# Altium schematic sheet NucciF.SchDoc: NucciF (part 2 of 2)
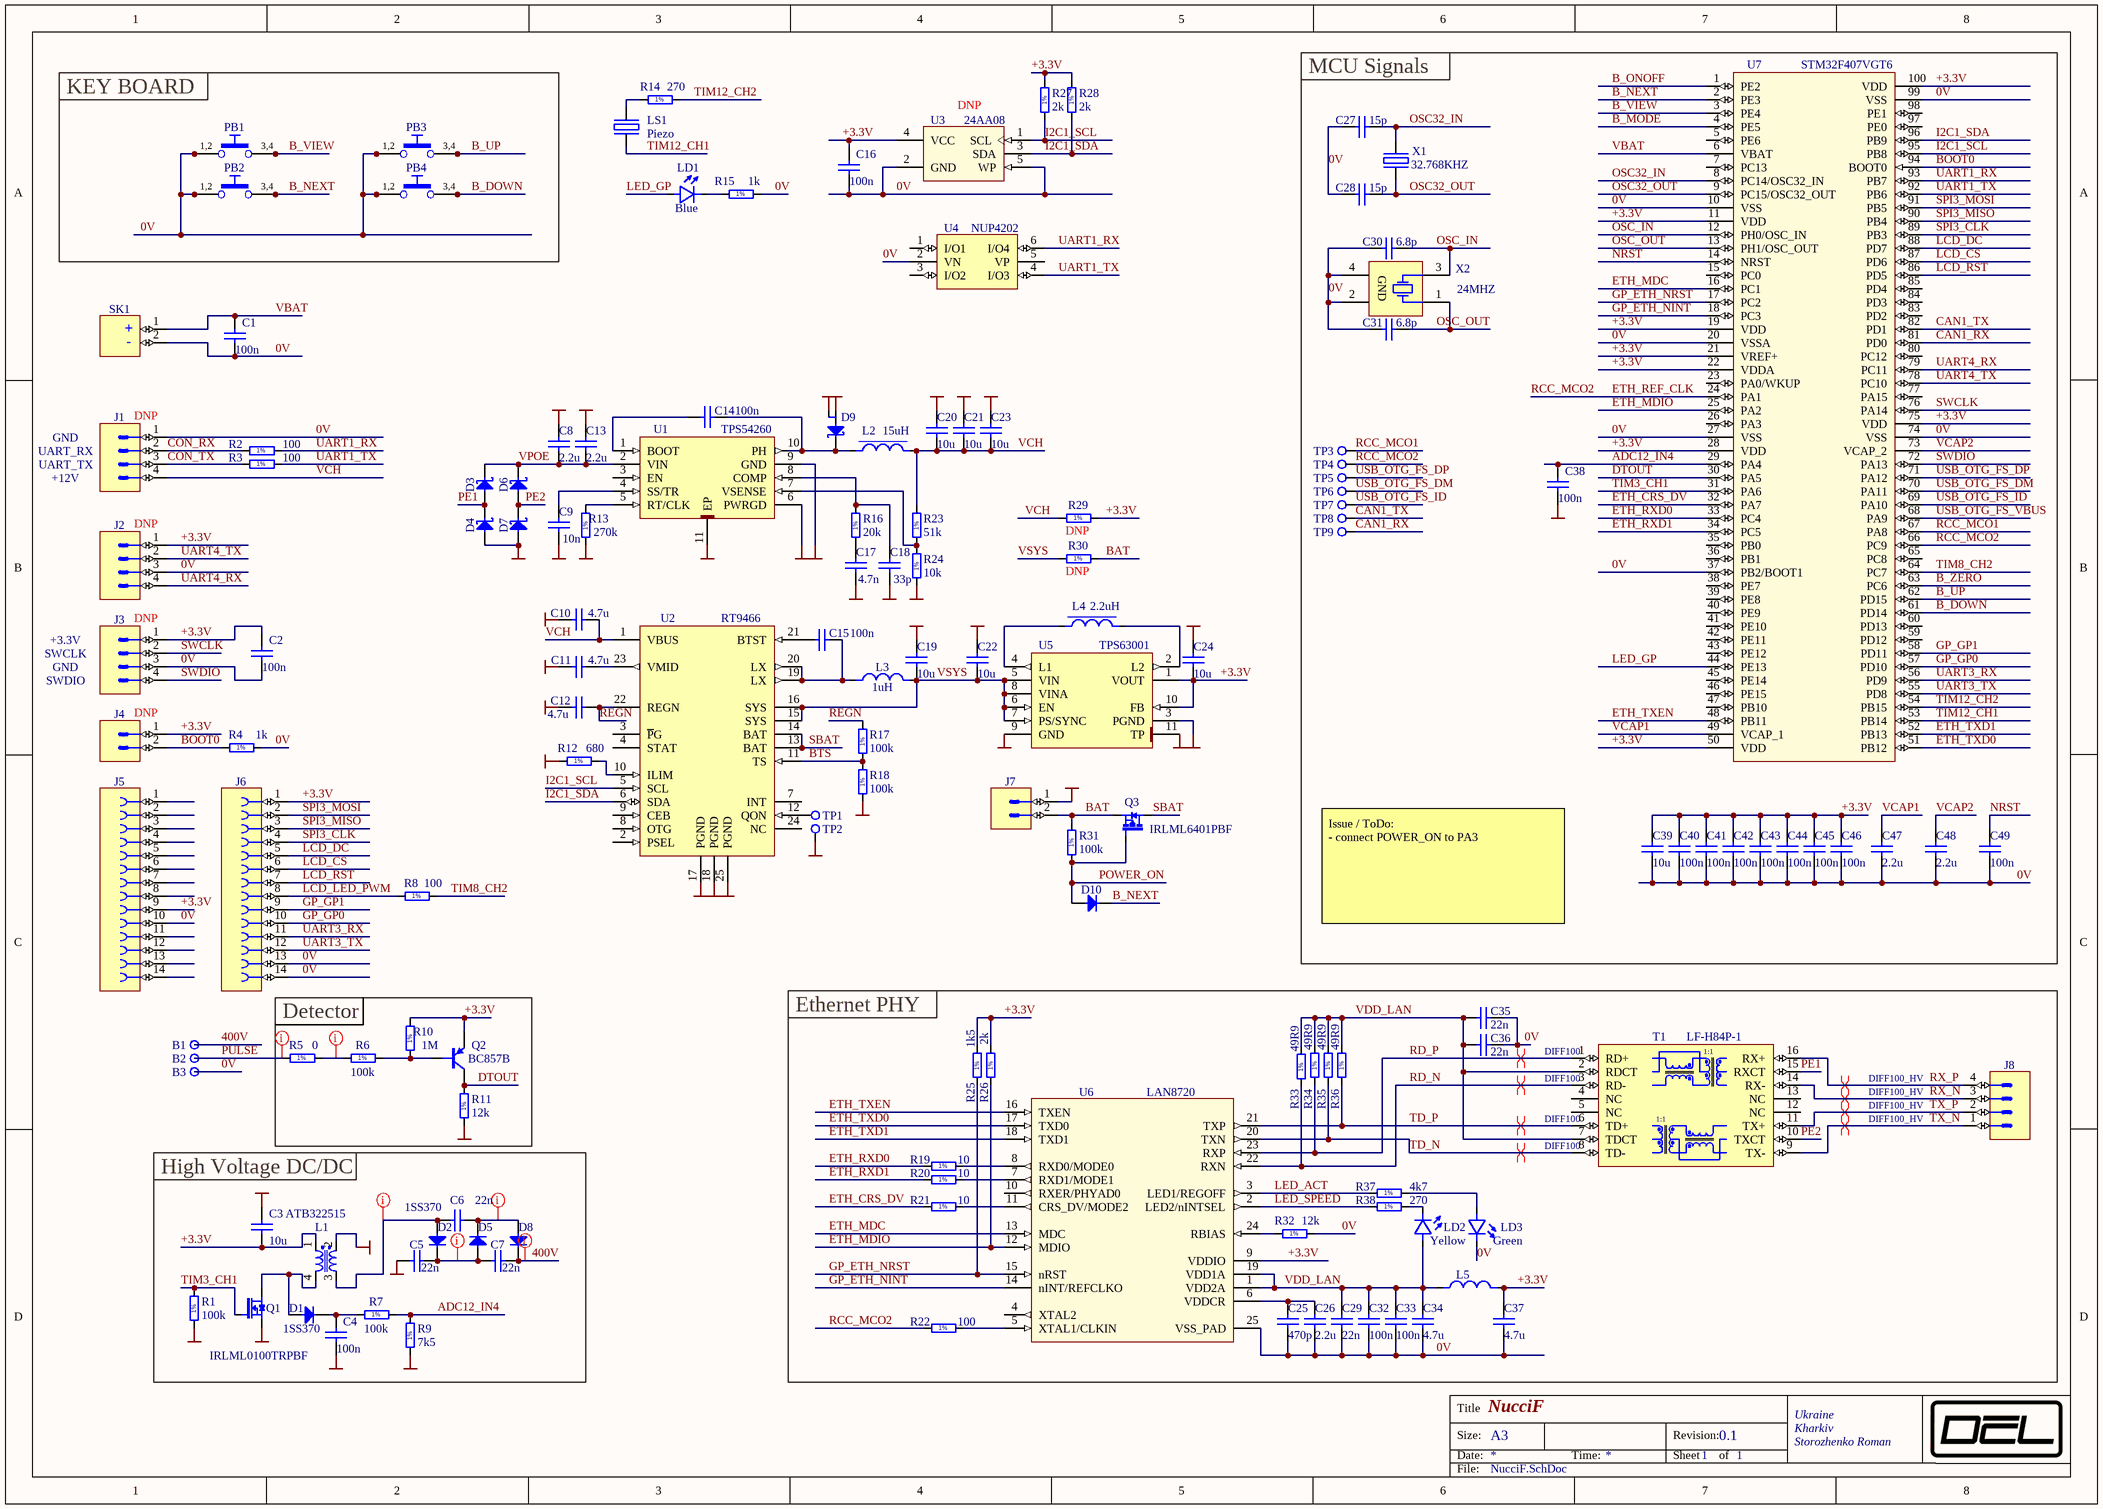
[diagram p1: NucciF.SchDoc]

## Library data of the parts
B1-B3 = PLATED_HOLE1.0_PAD1.5: Single Terminal Socket; Part Description: Plated Through Hole: Hole Dia.=1.0mm Pad Dia.=1.5mm; Mounted: No; Part Number: PLATED_HOLE1.0_PAD1.5; Component Kind: Standard (No BOM); Component Type: Standard (No BOM); Pin Count: 1; Family: Plated Hole; Socket: No; SMD: No; Status: None; ComponentHeight: 0mm; Author: CERN DEM JLC; CreateDate: 10/30/2008; LatestRevisionDate: 10/30/2008; PackageDescription: Plated Through Hole: Hole Dia.=1mm Pad Dia.=1.5mm
C1 C2 C4 C16 C32 C33 C38 C40-C46 C49 = CC0402_100NF_50V_10%_X7R: Non-polarised capacitor; Part Description: SMD Multilayer Chip Ceramic Capacitor; Manufacturer: GENERIC; Manufacturer1 Part Number: C0402B104K500NU; Voltage: 50V; TC: X7R; Tolerance: ±10%; Part Number: CC0402_100NF_50V_10%_X7R; Component Kind: Standard; Component Type: Standard; Pin Count: 2; Value: 100n; Status: Not Recommended; Manufacturer Part Number: CC0402_100NF_50V_10%_X7R; Case: 0402; Mounted: Yes; Socket: No; SMD: Yes; Manufacturer1 Example: HITANO; Manufacturer1 ComponentHeight: 0.55mm; Author: DEL; CreateDate: 13.11.2017; LatestRevisionDate: 13.11.2017
C3 C19-C24 C39 = CC0603_10UF_10V_20%_X5R: Non-polarised capacitor; Part Description: SMD Multilayer Chip Ceramic Capacitor; Manufacturer: GENERIC; Manufacturer1 Part Number: C0603C106M9PAC; Voltage: 10V; TC: X5R; Tolerance: ±20%; Part Number: CC0603_10UF_10V_20%_X5R; Component Kind: Standard; Component Type: Standard; Pin Count: 2; Value: 10u; Status: Preferred; Manufacturer Part Number: CC0603_10uF_10V_20%_X5R; Case: 0603; Mounted: Yes; Socket: No; SMD: Yes; Manufacturer1 Example: KEMET; Manufacturer1 ComponentHeight: 0.95mm; HelpURL: \\cern.ch\dfs\Applications\Altium\Datasheets\CC0603_X5R_KEMET.pdf; Author: CERN DEM JLC; CreateDate: 12/3/2007; LatestRevisionDate: 12/3/2007
C5-C7 = CC0805_22NF_500V_10%_X7R: Non-polarised capacitor; Part Description: SMD Multilayer Chip Ceramic Capacitor; Manufacturer: GENERIC; Manufacturer1 Part Number: C0805C223KCRACTU; Voltage: 500V; TC: X7R; Tolerance: ±10%; Part Number: CC0805_22NF_500V_10%_X7R; Component Kind: Standard; Component Type: Standard; Pin Count: 2; Value: 22n; Status: Preferred; Manufacturer Part Number: CC0805_22NF_500V_10%_X7R; Case: 0805; Mounted: Yes; Socket: No; SMD: Yes; Manufacturer1 Example: KEMET; Manufacturer1 ComponentHeight: 1.35mm; Author: DEL; CreateDate: 9/2/2025; LatestRevisionDate: 9/2/2025
C8 C13 = CC1206_2.2UF_100V_10%_X7R: Non-polarised capacitor; Part Description: SMD Multilayer Chip Ceramic Capacitor; Manufacturer: GENERIC; Manufacturer1 Part Number: C1206C225K4RAC; Voltage: 100V; TC: X7R; Tolerance: ±10%; Part Number: CC1206_2.2UF_100V_10%_X7R; Component Kind: Standard; Component Type: Standard; Pin Count: 2; Value: 2.2u; Status: Preferred; Manufacturer Part Number: CC1206_2.2UF_100V_10%_X7R; Case: 1206; Mounted: Yes; Socket: No; SMD: Yes; Manufacturer1 Example: SAMSUNG; Manufacturer1 ComponentHeight: 1.75mm; Author: DEL; CreateDate: 6/15/2025; LatestRevisionDate: 6/15/2025
C9 = CC0402_10NF_16V_10%_X7R: Non-polarised capacitor; Part Description: SMD Multilayer Chip Ceramic Capacitor; Manufacturer: GENERIC; Manufacturer1 Part Number: 223878715636; Voltage: 16V; TC: X7R; Tolerance: ±10%; Part Number: CC0402_10NF_16V_10%_X7R; Component Kind: Standard; Component Type: Standard; Pin Count: 2; Value: 10n; Status: Not Recommended; Manufacturer Part Number: CC0402_10NF_16V_10%_X7R; Case: 0402; Mounted: Yes; Socket: No; SMD: Yes; Manufacturer1 Example: PHYCOMP; Manufacturer1 ComponentHeight: 0.55mm; HelpURL: \\cern.ch\dfs\Applications\Altium\Datasheets\CC0402_X7R_PHYCOMP.pdf; Author: CERN DEM JLC; CreateDate: 12/3/2007; LatestRevisionDate: 12/3/2007
C10-C12 = CC0402_4.7UF_10V_20%_X5R: Non-polarised capacitor; Part Description: SMD Multilayer Chip Ceramic Capacitor; Manufacturer: GENERIC; Voltage: 10V; TC: X5R; Tolerance: ±20%; Part Number: CC0402_4.7UF_10V_20%_X5R; Component Kind: Standard; Component Type: Standard; Pin Count: 2; Value: 4.7u; Status: Preferred; Manufacturer Part Number: CC0402_4.7UF_10V_20%_X5R; Case: 0402; Mounted: Yes; Socket: No; SMD: Yes; Manufacturer1 ComponentHeight: 0.55mm; Author: DEL; CreateDate: 1/19/2025; LatestRevisionDate: 1/19/2025
C14 C15 = CC0402_100NF_16V_10%_X7R: Non-polarised capacitor; Part Description: SMD Multilayer Chip Ceramic Capacitor; Manufacturer: GENERIC; Manufacturer1 Part Number: 223878715649; Voltage: 16V; TC: X7R; Tolerance: ±10%; Part Number: CC0402_100NF_16V_10%_X7R; Component Kind: Standard; Component Type: Standard; Pin Count: 2; Value: 100n; Status: Not Recommended; Manufacturer Part Number: CC0402_100NF_16V_10%_X7R; Case: 0402; Mounted: Yes; Socket: No; SMD: Yes; Manufacturer1 Example: PHYCOMP; Manufacturer1 ComponentHeight: 0.55mm; HelpURL: \\cern.ch\dfs\Applications\Altium\Datasheets\CC0402_X7R_PHYCOMP.pdf; Author: CERN DEM JLC; CreateDate: 12/3/2007; LatestRevisionDate: 12/3/2007
C17 = CC0402_4.7NF_16V_10%_X7R: Non-polarised capacitor; Part Description: SMD Multilayer Chip Ceramic Capacitor; Manufacturer: GENERIC; Manufacturer1 Part Number: 223878715632; Voltage: 16V; TC: X7R; Tolerance: ±10%; Part Number: CC0402_4.7NF_16V_10%_X7R; Component Kind: Standard; Component Type: Standard; Pin Count: 2; Value: 4.7n; Status: Not Recommended; Manufacturer Part Number: CC0402_4.7NF_16V_10%_X7R; Case: 0402; Mounted: Yes; Socket: No; SMD: Yes; Manufacturer1 Example: PHYCOMP; Manufacturer1 ComponentHeight: 0.55mm; HelpURL: \\cern.ch\dfs\Applications\Altium\Datasheets\CC0402_X7R_PHYCOMP.pdf; Author: CERN DEM JLC; CreateDate: 12/3/2007; LatestRevisionDate: 12/3/2007
C18 = CC0402_33PF_50V_5%_NP0: Non-polarised capacitor; Part Description: SMD Multilayer Chip Ceramic Capacitor; Manufacturer: GENERIC; Manufacturer1 Part Number: 223886915339; Voltage: 50V; TC: NP0; Tolerance: ±5%; Part Number: CC0402_33PF_50V_5%_NP0; Component Kind: Standard; Component Type: Standard; Pin Count: 2; Value: 33p; Status: Not Recommended; Manufacturer Part Number: CC0402_33PF_50V_5%_NP0; Case: 0402; Mounted: Yes; Socket: No; SMD: Yes; Manufacturer1 Example: PHYCOMP; Manufacturer1 ComponentHeight: 0.55mm; HelpURL: \\cern.ch\dfs\Applications\Altium\Datasheets\CC0402_NP0_PHYCOMP.pdf; Author: CERN DEM JLC; CreateDate: 12/3/2007; LatestRevisionDate: 12/3/2007
C25 = CC0402_470PF_50V_10%_X7R: Non-polarised capacitor; Part Description: SMD Multilayer Chip Ceramic Capacitor; Manufacturer: GENERIC; Manufacturer1 Part Number: 223858715618; Voltage: 50V; TC: X7R; Tolerance: ±10%; Part Number: CC0402_470PF_50V_10%_X7R; Component Kind: Standard; Component Type: Standard; Pin Count: 2; Value: 470p; Status: Not Recommended; Manufacturer Part Number: CC0402_470PF_50V_10%_X7R; Case: 0402; Mounted: Yes; Socket: No; SMD: Yes; Manufacturer1 Example: PHYCOMP; Manufacturer1 ComponentHeight: 0.55mm; HelpURL: \\cern.ch\dfs\Applications\Altium\Datasheets\CC0402_NP0_PHYCOMP.pdf; Author: CERN DEM JLC; CreateDate: 03.12.2007; LatestRevisionDate: 03.12.2007
C26 C47 C48 = CC0402_2.2UF_6.3V_20%_X5R: Non-polarised capacitor; Part Description: SMD Multilayer Chip Ceramic Capacitor; Manufacturer: GENERIC; Voltage: 6.3V; TC: X5R; Tolerance: ±20%; Part Number: CC0402_2.2UF_6.3V_20%_X5R; Component Kind: Standard; Component Type: Standard; Pin Count: 2; Value: 2.2u; Status: Preferred; Manufacturer Part Number: CC0402_2.2UF_6.3V_20%_X5R; Case: 0402; Mounted: Yes; Socket: No; SMD: Yes; Manufacturer1 ComponentHeight: 0.55mm; HelpURL: \\cern.ch\dfs\Applications\Altium\Datasheets\CC0402_X5R_KEMET.pdf; Author: ELMAN; CreateDate: 19.05.2015; LatestRevisionDate: 19.05.2015
C27 C28 = CC0402_15PF_50V_5%_NP0: Non-polarised capacitor; Part Description: SMD Multilayer Chip Ceramic Capacitor; Manufacturer: GENERIC; Manufacturer1 Part Number: 223886915159; Voltage: 50V; TC: NP0; Tolerance: ±5%; Part Number: CC0402_15PF_50V_5%_NP0; Component Kind: Standard; Component Type: Standard; Pin Count: 2; Value: 15p; Status: Not Recommended; Manufacturer Part Number: CC0402_15PF_50V_5%_NP0; Case: 0402; Mounted: Yes; Socket: No; SMD: Yes; Manufacturer1 Example: PHYCOMP; Manufacturer1 ComponentHeight: 0.55mm; HelpURL: \\cern.ch\dfs\Applications\Altium\Datasheets\CC0402_NP0_PHYCOMP.pdf; Author: CERN DEM JLC; CreateDate: 03.12.2007; LatestRevisionDate: 03.12.2007
C29 C35 C36 = CC0402_22NF_16V_10%_X7R: Non-polarised capacitor; Part Description: SMD Multilayer Chip Ceramic Capacitor; Manufacturer: GENERIC; Manufacturer1 Part Number: 223878715641; Voltage: 16V; TC: X7R; Tolerance: ±10%; Part Number: CC0402_22NF_16V_10%_X7R; Component Kind: Standard; Component Type: Standard; Pin Count: 2; Value: 22n; Status: Not Recommended; Manufacturer Part Number: CC0402_22NF_16V_10%_X7R; Case: 0402; Mounted: Yes; Socket: No; SMD: Yes; Manufacturer1 Example: PHYCOMP; Manufacturer1 ComponentHeight: 0.55mm; HelpURL: \\cern.ch\dfs\Applications\Altium\Datasheets\CC0402_X7R_PHYCOMP.pdf; Author: CERN DEM JLC; CreateDate: 03.12.2007; LatestRevisionDate: 03.12.2007
C30 C31 = CC0402_6.8PF_50V_0.5PF_NP0: Non-polarised capacitor; Part Description: SMD Multilayer Chip Ceramic Capacitor; Manufacturer: GENERIC; Manufacturer1 Part Number: 223886915688; Voltage: 50V; TC: NP0; Tolerance: ±0.5pF; Part Number: CC0402_6.8PF_50V_0.5PF_NP0; Component Kind: Standard; Component Type: Standard; Pin Count: 2; Value: 6.8p; Status: Not Recommended; Manufacturer Part Number: CC0402_6.8PF_50V_0.5PF_NP0; Case: 0402; Mounted: Yes; Socket: No; SMD: Yes; Manufacturer1 Example: PHYCOMP; Manufacturer1 ComponentHeight: 0.55mm; HelpURL: \\cern.ch\dfs\Applications\Altium\Datasheets\CC0402_NP0_PHYCOMP.pdf; Author: CERN DEM JLC; CreateDate: 03.12.2007; LatestRevisionDate: 03.12.2007
C34 C37 = CC0603_4.7UF_10V_10%_X5R: Non-polarised capacitor; Part Description: SMD Multilayer Chip Ceramic Capacitor; Manufacturer: GENERIC; Manufacturer1 Part Number: C1608X5R1A475K080AC; Voltage: 10V; TC: X5R; Tolerance: ±10%; Part Number: CC0603_4.7UF_10V_10%_X5R; Component Kind: Standard; Component Type: Standard; Pin Count: 2; Value: 4.7u; Status: Preferred; Manufacturer Part Number: CC0603_4.7uF_10V_10%_X5R; Case: 0603; Mounted: Yes; Socket: No; SMD: Yes; Manufacturer1 Example: TDK; Manufacturer1 ComponentHeight: 0.95mm; Author: ELMAN; CreateDate: 13.11.2016; LatestRevisionDate: 13.11.2016
D1 D2 D5 D8 = 1SS370: Diode Anode Pin 1 Cathode Pin 3 (Pas de pin 2); Part Description: High Voltage, High Speed Switching Applications; Manufacturer: TOSHIBA; Voltage: 40V; Power: 250mW; Part Number: 1SS370; Component Kind: Standard; Component Type: Standard; Device: 1SS370; PackageDescription: SOT323, 0.65mm pitch; 3 pin, 1.25mm W X 2.00mm L, IPC Medium Density; Manufacturer Part Number: 1SS370; Pin Count: 3; Case: SOT323; Mounted: Yes; Socket: No; SMD: Yes; ComponentHeight: 1mm; Author: DEL; CreateDate: 6/5/2025; LatestRevisionDate: 6/5/2025
D3 D4 D6 D7 = MBR0540T1G: Schottky Diode; Part Description: Schottky Power Rectifier; Manufacturer: ON SEMICONDUCTOR; Voltage: 40V; Power: 500mA; Part Number: MBR0540T1G; Component Kind: Standard; Component Type: Standard; Device: MBR0540T1G; PackageDescription: Diode (SOD-123), 2.70mm W X 1.60mm L X 1.35mm H body, IPC Medium Density; Manufacturer Part Number: MBR0540T1G; Pin Count: 2; Case: SOD-123; Mounted: Yes; Socket: No; SMD: Yes; ComponentHeight: 1.35mm; HelpURL: \\cern.ch\dfs\Applications\Altium\Datasheets\MBR0540T1G.pdf; Author: CERN DEM JLC; CreateDate: 4/11/2011; LatestRevisionDate: 4/11/2011
D9 = SBRT15U100SP5: Diode  Schottky Anode pin 1 and 2 cathode pin 3; Part Description: Schottky Rectifier; Manufacturer: DIODES; Voltage: 100V; Power: 15A; Part Number: SBRT15U100SP5; Component Kind: Standard; Component Type: Standard; Device: SBRT15U100SP5; PackageDescription: DFN, 3-Leads, Body 4.05x6.6mm; Manufacturer Part Number: SBRT15U100SP5; Pin Count: 3; Case: DFN; Mounted: Yes; Socket: No; SMD: Yes; ComponentHeight: 1.15mm; Author: DEL; CreateDate: 6/24/2022; LatestRevisionDate: 6/24/2022
D10 = 1N4148W: Diode; Part Description: Small Signal Diode; Manufacturer: VISHAY SEMICONDUCTORS; Manufacturer Part Number: 1N4148W-E3-08; Voltage: 75V; Power: 150mA; Part Number: 1N4148W; Component Kind: Standard; Component Type: Standard; Device: 1N4148W; PackageDescription: SOD Diode (SOD-123); 2.70mm W X 1.55mm L X 1.45mm H body, IPC Medium Density; Pin Count: 2; Case: SOD-123; Mounted: Yes; Socket: No; SMD: Yes; ComponentHeight: 1.45mm; Author: DEL; CreateDate: 1/27/2018; LatestRevisionDate: 1/27/2018
J1-J3 = 3M_2304-6111-TG: Connector 4 Male; Part Description: 4 Contacts - Vertival Contacts Straight Strip Header Pitch 2.54; Manufacturer: 3M; Part Number: 3M_2304-6111-TG; Component Kind: Standard; Component Type: Standard; Pin Count: 4; Family: Header 4; Socket: No; SMD: No; Status: None; Manufacturer Part Number: 3M_2304-6111-TG; ComponentHeight: 8.4mm; Author: DEL; CreateDate: 2018-09-13; LatestRevisionDate: 2018-09-13
J4 J7 = 3M_2302-6111-TG: Connector 2 Male; Part Description: 2 Contacts - Horizontal Contacts Straight Strip Header Pitch 2.54; Manufacturer: 3M; Part Number: 3M_2302-6111-TG; Component Kind: Standard; Component Type: Standard; Pin Count: 2; Family: Header 2; Socket: No; SMD: No; Status: None; Manufacturer Part Number: 3M_2302-6111-TG; ComponentHeight: 8.4mm; Author: DEL; CreateDate: 2018-09-13; LatestRevisionDate: 2018-09-13
  J7: Mounted: Yes
J5 J6 = 3M_955114-6102-AR: Connector 14 Female; Part Description: 14 Contacts - 2mm x 2 mm Straight, Boardmount Socket, 950 Serie; Manufacturer: 3M; Part Number: 3M_955114-6102-AR; Component Kind: Standard; Component Type: Standard; Pin Count: 14; Family: Socket 14; Mounted: Yes; Socket: No; SMD: No; Status: None; Manufacturer Part Number: 955114-6102-AR; ComponentHeight: 4.3mm; Author: DEL; CreateDate: 02.11.2017; LatestRevisionDate: 02.11.2017
J8 = MOLEX_22-03-5045: Connector 4 Male; Part Description: 2.50mm Pitch SPOX Wire-to-Board Header, Vertical, Shrouded, 4 Circuits, Tin (Sn) Plating; Manufacturer: MOLEX; Part Number: MOLEX_22-03-5045; Component Kind: Standard; Component Type: Standard; Pin Count: 4; Family: SPOX; Mounted: Yes; Socket: No; SMD: No; Status: None; Manufacturer Part Number: 22-27-2041; ComponentHeight: 5.9mm; Author: DEL; CreateDate: 21.10.2017; LatestRevisionDate: 21.10.2017
L1 = XFMR_TDK_ATB322515-0110-T000: Inductor Common Mode; Part Description: 1:10 Step-up Transformers; Manufacturer: TDK; Value: Step-up Transformers; Part Number: XFMR_TDK_ATB322515-0110-T000; Component Kind: Standard; Component Type: Standard; Pin Count: 16; Status: None; Manufacturer Part Number: ATB322515-0110-T000; Mounted: Yes; Socket: No; SMD: Yes; ComponentHeight: 1.55mm; Author: DEL; CreateDate: 6/4/2025; LatestRevisionDate: 6/4/2025
L2 = IND_2.2UH_20%_VISHAY_IHLP2525CZER2R2M01: Inductor With Magnetic core; Part Number: IND_15UH_20%_HPI0630; Part Description: SMT Inductors SIMID Series; Manufacturer: FERROCORE; Manufacturer Part Number: HPI0630-150; Power: 2.7A; Resistance: 0.11R; Tolerance: ±20%; Component Kind: Standard; Component Type: Standard; Pin Count: 2; Value: 15uH; Status: Preferred; Mounted: Yes; Socket: No; SMD: Yes; ComponentHeight: 3mm; Author: DEL; CreateDate: 11/14/2017; LatestRevisionDate: 11/14/2017
L3 = IND_1UH_20%_COILCRAFT_XAL4020-102ME: Inductor; Part Description: Shielded SMD Power Inductors; Power: 9.6A; Resistance: 0.014R; Tolerance: ±20%; Part Number: IND_1UH_20%_COILCRAFT_XAL4020-102ME; Component Kind: Standard; Component Type: Standard; Pin Count: 2; Value: 1uH; Status: None; Manufacturer: COILCRAFT; Manufacturer Part Number: XAL4020-102ME; Mounted: Yes; Socket: No; SMD: Yes; ComponentHeight: 2.1mm; Author: ROMAN; CreateDate: 6/30/2016; LatestRevisionDate: 6/30/2016
L4 = IND_2.2UH_20%_TDK_VLS3010CX-2R2M-1: Inductor With Magnetic core; Part Description: SMT Power Inductors; Manufacturer: TDK; Power: 1.11A; Resistance: 0.065R; Tolerance: ±20%; Part Number: IND_2.2UH_20%_TDK_VLS3010CX-2R2M-1; Component Kind: Standard; Component Type: Standard; Pin Count: 2; Value: 2.2uH; Status: None; Manufacturer Part Number: VLS3010CX-2R2M-1; Mounted: Yes; Socket: No; SMD: Yes; ComponentHeight: 1mm; Author: DEL; CreateDate: 1/23/2022; LatestRevisionDate: 1/23/2022
L5 = IND1008_2.2UH_20%_TDK_MLP2520S2R2MT0S1: Inductor; Part Description: SMT Inductors; Manufacturer: TDK; Power: 1.2A; Resistance: 0.117R; Tolerance: ±20%; Part Number: IND1008_2.2UH_20%_TDK_MLP2520S2R2MT0S1; Component Kind: Standard; Component Type: Standard; Pin Count: 2; Value: 2.2uH; Status: None; Manufacturer Part Number: MLP2520S2R2MT0S1; Case: 1008; Mounted: Yes; Socket: No; SMD: Yes; ComponentHeight: 1mm; HelpURL: C:\eftek\library\doc\DS_SPICE\capacitors\TDK\inductor_commercial_power_mlp2520_en.pdf; Author: ELMAN; CreateDate: 02.02.2016; LatestRevisionDate: 02.02.2016
LD1 = LED_OF-SMD1608B: LED 1C 2A; Part Description: Surface Mount Red LED (0603 Case); Manufacturer: OPTOFLASH; Part Number: LED_OF-SMD1608B; Component Kind: Standard; Component Type: Standard; Color: Blue; PackageDescription: Chip Blue LED, 2-Leads, Body 1.6x0.8mm, IPC Medium Density; Manufacturer Part Number: OF-SMD1608B; Pin Count: 2; Case: 0603; Mounted: Yes; Socket: No; SMD: Yes; ComponentHeight: 0.8mm; Author: DEL; CreateDate: 11.12.2017; LatestRevisionDate: 11.12.2017
LD2 = LED_OF-SMD1608Y: LED 1C 2A; Part Description: Surface Mount Red LED (0603 Case); Manufacturer: OPTOFLASH; Manufacturer Part Number: OF-SMD1608R; Part Number: LED_OF-SMD1608Y; Component Kind: Standard; Component Type: Standard; Color: Yellow; PackageDescription: Chip Yellow LED, 2-Leads, Body 1.6x0.8mm, IPC Medium Density; Pin Count: 2; Case: 0603; Mounted: Yes; Socket: No; SMD: Yes; ComponentHeight: 0.8mm; Author: DEL; CreateDate: 11.12.2017; LatestRevisionDate: 11.12.2017
LD3 = LED_OF-SMD1608G: LED 1C 2A; Part Description: Surface Mount Green LED (0603 Case); Manufacturer: OPTOFLASH; Part Number: LED_OF-SMD1608G; Component Kind: Standard; Component Type: Standard; Color: Green; PackageDescription: Chip Green LED, 2-Leads, Body 1.6x0.8mm, IPC Medium Density; Manufacturer Part Number: OF-SMD1608G; Pin Count: 2; Case: 0603; Mounted: Yes; Socket: No; SMD: Yes; ComponentHeight: 0.8mm; Author: ELMAN; CreateDate: 27.08.2015; LatestRevisionDate: 27.08.2015
LS1 = HPS13C: Piezo Sounder; Part Description: Piezo sound generator; Manufacturer: JL WORLD; Output: >= 80 dB; Part Number: HPS13C; Component Kind: Standard; Component Type: Standard; Pin Count: 2; PackageDescription: 12.8 x 12.8 x 2.5 mm; Family: Piezo; Mounted: Yes; Socket: No; SMD: Yes; Manufacturer Part Number: HPS13C; ComponentHeight: 1.2mm; Author: DEL; CreateDate: 10.11.2017; LatestRevisionDate: 10.11.2017
PB1-PB4 = PB_E-SWITCH_TL1105HF100Q: Push-Button Switch SPDT; Part Description: 12VDC 50mA SPST Tactile  Push-Button Switch; Manufacturer Part Number: TL3305AF260QG; Part Number: PB_E-SWITCH_TL1105HF100Q; Component Kind: Standard; Component Type: Standard; Pin Count: 4; PackageDescription: 6mm x 6mm Body, Surface Mount Tactile Switches; Family: Push Button; Mounted: Yes; Socket: No; SMD: Yes; Status: None; Manufacturer: E-SWITCH; ComponentHeight: 3.8mm; Author: DEL; CreateDate: 06.11.2017; LatestRevisionDate: 07.11.2017
Q1 = IRLML0100TRPBF: N-CHANNEL MOSFET WITH DIODE; Part Description: 100V 1.6A N-Channel HEXFET® Power MOSFET; Manufacturer: INTERNATIONAL RECTIFIER; Part Number: IRLML0100TRPBF; Component Kind: Standard; Component Type: Standard; Device: IRLML0100TRPBF; PackageDescription: SOT, 0.95mm, pitch; 3 pin,1.30mm W X 2.92mm L X 1.12mm H body, IPC Medium Density; Manufacturer Part Number: IRLML0100TRPBF; Pin Count: 3; Case: SOT23-3; Mounted: Yes; Socket: No; SMD: Yes; ComponentHeight: 1.12mm; HelpURL: \\cern.ch\dfs\Applications\Altium\Datasheets\IRLML0100TRPBF.pdf; Author: CERN DEM JLC; CreateDate: 10/6/2011; LatestRevisionDate: 10/6/2011
Q2 = BC857B: PNP Transistor; Part Description: 45V, 100mA PNP general-purpose transistors; Manufacturer: NXP SEMICONDUCTORS; Part Number: BC857B; Component Kind: Standard; Component Type: Standard; Device: BC857B; PackageDescription: SOT23, 3 pin, Pitch 0.95mm - 1.3mm W X 2.9mm L X 1.1mm H, IPC Medium Density; Manufacturer Part Number: BC857B; Pin Count: 3; Case: SOT23-3; Mounted: Yes; Socket: No; SMD: Yes; ComponentHeight: 1.1mm; HelpURL: \\cern.ch\dfs\Applications\Altium\Datasheets\BC857B.pdf; Author: CERN DEM JLC; CreateDate: 6/14/2011; LatestRevisionDate: 6/14/2011
Q3 = IRLML6401PBF: P-CHANNEL MOSFET WITH DIODE; Part Description: -12V -4.3A P-Channel HEXFET® Power MOSFET; Manufacturer: INTERNATIONAL RECTIFIER; Part Number: IRLML6401PBF; Component Kind: Standard; Component Type: Standard; Device: IRLML6401PBF; PackageDescription: SOT, 0.95mm, pitch; 3 pin,1.30mm W X 2.92mm L X 1.12mm H body, IPC Medium Density; Manufacturer Part Number: IRLML6401PBF; Pin Count: 3; Case: SOT23-3; Mounted: Yes; Socket: No; SMD: Yes; ComponentHeight: 1.12mm; HelpURL: \\cern.ch\dfs\Applications\Altium\Datasheets\IRLML6402PBF.pdf; Author: CERN DEM JLC; CreateDate: 8/29/2011; LatestRevisionDate: 8/29/2011
R1 R7 R17 R18 R31 = R0402_100K_1%_0.0625W_100PPM: Resistor - 1%; Part Description: General Purpose Thick Film Chip Resistor; Manufacturer: GENERIC; Manufacturer1 Part Number: 232270671004; TC: ±100ppm/°C; Part Number: R0402_100K_1%_0.0625W_100PPM; Component Kind: Standard; Component Type: Standard; Pin Count: 2; Value: 100k; Status: Not recommended; Power: 0.0625W; Tolerance: ±1%; Manufacturer Part Number: R0402_100K_1%_0.0625W_100PPM; Case: 0402; Mounted: Yes; Socket: No; SMD: Yes; Manufacturer1 Example: PHYCOMP; Manufacturer1 ComponentHeight: 0.4mm; HelpURL: \\cern.ch\dfs\Applications\Altium\Datasheets\R0402_Phycomp_RC0402.pdf; Author: CERN DEM JLC; CreateDate: 12/3/2007; LatestRevisionDate: 3/13/2008
R2 R3 R8 R22 = R0402_100R_1%_0.0625W_100PPM: Resistor - 1%; Part Description: General Purpose Thick Film Chip Resistor; Manufacturer: GENERIC; Manufacturer1 Part Number: 232270671001; TC: ±100ppm/°C; Part Number: R0402_100R_1%_0.0625W_100PPM; Component Kind: Standard; Component Type: Standard; Pin Count: 2; Value: 100; Status: Not recommended; Power: 0.0625W; Tolerance: ±1%; Manufacturer Part Number: R0402_100R_1%_0.0625W_100PPM; Case: 0402; Mounted: Yes; Socket: No; SMD: Yes; Manufacturer1 Example: PHYCOMP; Manufacturer1 ComponentHeight: 0.4mm; HelpURL: \\cern.ch\dfs\Applications\Altium\Datasheets\R0402_Phycomp_RC0402.pdf; Author: CERN DEM JLC; CreateDate: 03.12.2007; LatestRevisionDate: 13.03.2008
R4 R15 = R0402_1K_1%_0.0625W_100PPM: Resistor - 1%; Part Description: General Purpose Thick Film Chip Resistor; Manufacturer: GENERIC; Manufacturer1 Part Number: 232270671002; TC: ±100ppm/°C; Part Number: R0402_1K_1%_0.0625W_100PPM; Component Kind: Standard; Component Type: Standard; Pin Count: 2; Value: 1k; Status: Not recommended; Power: 0.0625W; Tolerance: ±1%; Manufacturer Part Number: R0402_1K_1%_0.0625W_100PPM; Case: 0402; Mounted: Yes; Socket: No; SMD: Yes; Manufacturer1 Example: PHYCOMP; Manufacturer1 ComponentHeight: 0.4mm; HelpURL: \\cern.ch\dfs\Applications\Altium\Datasheets\R0402_Phycomp_RC0402.pdf; Author: CERN DEM JLC; CreateDate: 03.12.2007; LatestRevisionDate: 13.03.2008
R5 = R0805_0R_JUMPER: Resistor - 1%; Part Description: 2A (0.05R Max DC Resistance) Zero Ohm Jumper; Manufacturer: GENERIC; Manufacturer1 Part Number: NRC10Z0; Part Number: R0805_0R_JUMPER; Component Kind: Standard; Component Type: Standard; Pin Count: 2; Value: 0; Status: Preferred; Manufacturer Part Number: R0805_0R_JUMPER; Case: 0805; Mounted: Yes; Socket: No; SMD: Yes; Manufacturer1 Example: NIC COMPONENT; Manufacturer1 ComponentHeight: 0.6mm; HelpURL: \\cern.ch\dfs\Applications\Altium\Datasheets\R0805_NIC_NRC.pdf; Author: CERN DEM JLC; CreateDate: 12/3/2007; LatestRevisionDate: 3/13/2008
R6 = R0805_100K_1%_0.125W_100PPM: Resistor - 1%; Part Description: General Purpose Thick Film Chip Resistor; Manufacturer: GENERIC; Manufacturer1 Part Number: NRC10F1003TRF; Power: 0.125W; TC: ±100ppm/°C; Part Number: R0805_100K_1%_0.125W_100PPM; Component Kind: Standard; Component Type: Standard; Pin Count: 2; Value: 100k; Status: Preferred; Tolerance: ±1%; Manufacturer Part Number: R0805_100K_1%_0.125W_100PPM; Case: 0805; Mounted: Yes; Socket: No; SMD: Yes; Manufacturer1 Example: NIC COMPONENT; Manufacturer1 ComponentHeight: 0.6mm; HelpURL: \\cern.ch\dfs\Applications\Altium\Datasheets\R0805_NIC_NRC.pdf; Author: CERN DEM JLC; CreateDate: 12/3/2007; LatestRevisionDate: 3/13/2008
R9 = R0402_7K5_1%_0.0625W_100PPM: Resistor - 1%; Part Description: General Purpose Thick Film Chip Resistor; Manufacturer: GENERIC; Manufacturer1 Part Number: 232270677502; TC: ±100ppm/°C; Part Number: R0402_7K5_1%_0.0625W_100PPM; Component Kind: Standard; Component Type: Standard; Pin Count: 2; Value: 7k5; Status: Not recommended; Power: 0.0625W; Tolerance: ±1%; Manufacturer Part Number: R0402_7K5_1%_0.0625W_100PPM; Case: 0402; Mounted: Yes; Socket: No; SMD: Yes; Manufacturer1 Example: PHYCOMP; Manufacturer1 ComponentHeight: 0.4mm; HelpURL: \\cern.ch\dfs\Applications\Altium\Datasheets\R0402_Phycomp_RC0402.pdf; Author: CERN DEM JLC; CreateDate: 12/3/2007; LatestRevisionDate: 3/13/2008
R10 = R0402_1M_1%_0.0625W_100PPM: Resistor - 1%; Part Description: General Purpose Thick Film Chip Resistor; Manufacturer: GENERIC; Manufacturer1 Part Number: 232270671005; TC: ±100ppm/°C; Part Number: R0402_1M_1%_0.0625W_100PPM; Component Kind: Standard; Component Type: Standard; Pin Count: 2; Value: 1M; Status: Not recommended; Power: 0.0625W; Tolerance: ±1%; Manufacturer Part Number: R0402_1M_1%_0.0625W_100PPM; Case: 0402; Mounted: Yes; Socket: No; SMD: Yes; Manufacturer1 Example: PHYCOMP; Manufacturer1 ComponentHeight: 0.4mm; HelpURL: \\cern.ch\dfs\Applications\Altium\Datasheets\R0402_Phycomp_RC0402.pdf; Author: CERN DEM JLC; CreateDate: 12/3/2007; LatestRevisionDate: 3/13/2008
R11 R32 = R0402_12K_1%_0.0625W_100PPM: Resistor - 1%; Part Description: General Purpose Thick Film Chip Resistor; Manufacturer: GENERIC; Manufacturer1 Part Number: 232270671203; TC: ±100ppm/°C; Part Number: R0402_12K_1%_0.0625W_100PPM; Component Kind: Standard; Component Type: Standard; Pin Count: 2; Value: 12k; Status: Not recommended; Power: 0.0625W; Tolerance: ±1%; Manufacturer Part Number: R0402_12K_1%_0.0625W_100PPM; Case: 0402; Mounted: Yes; Socket: No; SMD: Yes; Manufacturer1 Example: PHYCOMP; Manufacturer1 ComponentHeight: 0.4mm; HelpURL: \\cern.ch\dfs\Applications\Altium\Datasheets\R0402_Phycomp_RC0402.pdf; Author: CERN DEM JLC; CreateDate: 03.12.2007; LatestRevisionDate: 13.03.2008
R12 = R0402_680R_1%_0.0625W_100PPM: Resistor - 1%; Part Description: General Purpose Thick Film Chip Resistor; Manufacturer: GENERIC; Manufacturer1 Part Number: 232270676801; TC: ±100ppm/°C; Part Number: R0402_680R_1%_0.0625W_100PPM; Component Kind: Standard; Component Type: Standard; Pin Count: 2; Value: 680; Status: Not recommended; Power: 0.0625W; Tolerance: ±1%; Manufacturer Part Number: R0402_680R_1%_0.0625W_100PPM; Case: 0402; Mounted: Yes; Socket: No; SMD: Yes; Manufacturer1 Example: PHYCOMP; Manufacturer1 ComponentHeight: 0.4mm; HelpURL: \\cern.ch\dfs\Applications\Altium\Datasheets\R0402_Phycomp_RC0402.pdf; Author: CERN DEM JLC; CreateDate: 12/3/2007; LatestRevisionDate: 3/13/2008
R13 = R0402_270K_1%_0.0625W_100PPM: Resistor - 1%; Part Description: General Purpose Thick Film Chip Resistor; Manufacturer: GENERIC; Manufacturer1 Part Number: 232270672704; TC: ±100ppm/°C; Part Number: R0402_270K_1%_0.0625W_100PPM; Component Kind: Standard; Component Type: Standard; Pin Count: 2; Value: 270k; Status: Not recommended; Power: 0.0625W; Tolerance: ±1%; Manufacturer Part Number: R0402_270K_1%_0.0625W_100PPM; Case: 0402; Mounted: Yes; Socket: No; SMD: Yes; Manufacturer1 Example: PHYCOMP; Manufacturer1 ComponentHeight: 0.4mm; HelpURL: \\cern.ch\dfs\Applications\Altium\Datasheets\R0402_Phycomp_RC0402.pdf; Author: CERN DEM JLC; CreateDate: 12/3/2007; LatestRevisionDate: 3/13/2008
R14 R38 = R0402_270R_1%_0.0625W_100PPM: Resistor - 1%; Part Description: General Purpose Thick Film Chip Resistor; Manufacturer: GENERIC; Manufacturer1 Part Number: 232270672701; TC: ±100ppm/°C; Part Number: R0402_270R_1%_0.0625W_100PPM; Component Kind: Standard; Component Type: Standard; Pin Count: 2; Value: 270; Status: Not recommended; Power: 0.0625W; Tolerance: ±1%; Manufacturer Part Number: R0402_270R_1%_0.0625W_100PPM; Case: 0402; Mounted: Yes; Socket: No; SMD: Yes; Manufacturer1 Example: PHYCOMP; Manufacturer1 ComponentHeight: 0.4mm; HelpURL: \\cern.ch\dfs\Applications\Altium\Datasheets\R0402_Phycomp_RC0402.pdf; Author: CERN DEM JLC; CreateDate: 2007-12-03; LatestRevisionDate: 2008-03-13
R16 = R0402_20K_1%_0.0625W_100PPM: Resistor - 1%; Part Description: General Purpose Thick Film Chip Resistor; Manufacturer: GENERIC; Manufacturer1 Part Number: 232270672003; TC: ±100ppm/°C; Part Number: R0402_20K_1%_0.0625W_100PPM; Component Kind: Standard; Component Type: Standard; Pin Count: 2; Value: 20k; Status: Not recommended; Power: 0.0625W; Tolerance: ±1%; Manufacturer Part Number: R0402_20K_1%_0.0625W_100PPM; Case: 0402; Mounted: Yes; Socket: No; SMD: Yes; Manufacturer1 Example: PHYCOMP; Manufacturer1 ComponentHeight: 0.4mm; HelpURL: \\cern.ch\dfs\Applications\Altium\Datasheets\R0402_Phycomp_RC0402.pdf; Author: CERN DEM JLC; CreateDate: 12/3/2007; LatestRevisionDate: 3/13/2008
R19-R21 = R0402_10R_1%_0.0625W_200PPM: Resistor - 1%; Part Description: General Purpose Thick Film Chip Resistor; Manufacturer: GENERIC; Manufacturer1 Part Number: 232270671009; TC: ±200ppm/°C; Part Number: R0402_10R_1%_0.0625W_200PPM; Component Kind: Standard; Component Type: Standard; Pin Count: 2; Value: 10; Status: Not recommended; Power: 0.0625W; Tolerance: ±1%; Manufacturer Part Number: R0402_10R_1%_0.0625W_200PPM; Case: 0402; Mounted: Yes; Socket: No; SMD: Yes; Manufacturer1 Example: PHYCOMP; Manufacturer1 ComponentHeight: 0.4mm; HelpURL: \\cern.ch\dfs\Applications\Altium\Datasheets\R0402_Phycomp_RC0402.pdf; Author: CERN DEM JLC; CreateDate: 24.06.2009; LatestRevisionDate: 13.03.2008
R23 = R0402_51K_1%_0.0625W_100PPM: Resistor - 1%; Part Description: General Purpose Thick Film Chip Resistor; Manufacturer: GENERIC; Manufacturer1 Part Number: 232270674703; TC: ±100ppm/°C; Part Number: R0402_51K_1%_0.0625W_100PPM; Component Kind: Standard; Component Type: Standard; Pin Count: 2; Value: 51k; Status: Not recommended; Power: 0.0625W; Tolerance: ±1%; Manufacturer Part Number: R0402_51K_1%_0.0625W_100PPM; Case: 0402; Mounted: Yes; Socket: No; SMD: Yes; Manufacturer1 Example: PHYCOMP; Manufacturer1 ComponentHeight: 0.4mm; HelpURL: \\cern.ch\dfs\Applications\Altium\Datasheets\R0402_Phycomp_RC0402.pdf; Author: CERN DEM JLC; CreateDate: 12/3/2007; LatestRevisionDate: 3/13/2008
R24 = R0402_10K_1%_0.0625W_100PPM: Resistor - 1%; Part Description: General Purpose Thick Film Chip Resistor; Manufacturer: GENERIC; Manufacturer1 Part Number: 232270671003; TC: ±100ppm/°C; Part Number: R0402_10K_1%_0.0625W_100PPM; Component Kind: Standard; Component Type: Standard; Pin Count: 2; Value: 10k; Status: Not recommended; Power: 0.0625W; Tolerance: ±1%; Manufacturer Part Number: R0402_10K_1%_0.0625W_100PPM; Case: 0402; Mounted: Yes; Socket: No; SMD: Yes; Manufacturer1 Example: PHYCOMP; Manufacturer1 ComponentHeight: 0.4mm; HelpURL: \\cern.ch\dfs\Applications\Altium\Datasheets\R0402_Phycomp_RC0402.pdf; Author: CERN DEM JLC; CreateDate: 12/3/2007; LatestRevisionDate: 3/13/2008
R25 = R0402_1K5_1%_0.0625W_100PPM: Resistor - 1%; Part Description: General Purpose Thick Film Chip Resistor; Manufacturer: GENERIC; Manufacturer1 Part Number: 232270671502; TC: ±100ppm/°C; Part Number: R0402_1K5_1%_0.0625W_100PPM; Component Kind: Standard; Component Type: Standard; Pin Count: 2; Value: 1k5; Status: Not recommended; Power: 0.0625W; Tolerance: ±1%; Manufacturer Part Number: R0402_1K5_1%_0.0625W_100PPM; Case: 0402; Mounted: Yes; Socket: No; SMD: Yes; Manufacturer1 Example: PHYCOMP; Manufacturer1 ComponentHeight: 0.4mm; HelpURL: \\cern.ch\dfs\Applications\Altium\Datasheets\R0402_Phycomp_RC0402.pdf; Author: CERN DEM JLC; CreateDate: 03.12.2007; LatestRevisionDate: 13.03.2008
R26-R28 = R0402_2K_1%_0.0625W_100PPM: Resistor - 1%; Part Description: General Purpose Thick Film Chip Resistor; Manufacturer: GENERIC; Manufacturer1 Part Number: 232270672002; TC: ±100ppm/°C; Part Number: R0402_2K_1%_0.0625W_100PPM; Component Kind: Standard; Component Type: Standard; Pin Count: 2; Value: 2k; Status: Not recommended; Power: 0.0625W; Tolerance: ±1%; Manufacturer Part Number: R0402_2K_1%_0.0625W_100PPM; Case: 0402; Mounted: Yes; Socket: No; SMD: Yes; Manufacturer1 Example: PHYCOMP; Manufacturer1 ComponentHeight: 0.4mm; HelpURL: \\cern.ch\dfs\Applications\Altium\Datasheets\R0402_Phycomp_RC0402.pdf; Author: CERN DEM JLC; CreateDate: 03.12.2007; LatestRevisionDate: 13.03.2008
R29 R30 = R0402_0R_JUMPER: Resistor - 1%; Part Description: 1A (0.05R Max DC Resistance) Zero Ohm Jumper; Manufacturer: GENERIC; Manufacturer1 Part Number: 232270591001; Part Number: R0402_0R_JUMPER; Component Kind: Standard; Component Type: Standard; Pin Count: 2; Value: 0; Status: Not recommended; Manufacturer Part Number: R0402_0R_JUMPER; Case: 0402; Socket: No; SMD: Yes; Manufacturer1 Example: PHYCOMP; Manufacturer1 ComponentHeight: 0.4mm; HelpURL: \\cern.ch\dfs\Applications\Altium\Datasheets\R0402_Phycomp_RC0402.pdf; Author: CERN DEM JLC; CreateDate: 12/3/2007; LatestRevisionDate: 3/13/2008
R33-R36 = R0402_49R9_1%_0.0625W_100PPM: Resistor - 1%; Part Description: General Purpose Thick Film Chip Resistor; Manufacturer: GENERIC; Manufacturer1 Part Number: 232270674702; TC: ±100ppm/°C; Part Number: R0402_49R9_1%_0.0625W_100PPM; Component Kind: Standard; Component Type: Standard; Pin Count: 2; Value: 49R9; Status: Not recommended; Power: 0.0625W; Tolerance: ±1%; Manufacturer Part Number: R0402_49R9_1%_0.0625W_100PPM; Case: 0402; Mounted: Yes; Socket: No; SMD: Yes; Manufacturer1 Example: PHYCOMP; Manufacturer1 ComponentHeight: 0.4mm; HelpURL: \\cern.ch\dfs\Applications\Altium\Datasheets\R0402_Phycomp_RC0402.pdf; Author: ELMAN; CreateDate: 20.05.2015; LatestRevisionDate: 20.05.2015
R37 = R0402_4K7_1%_0.0625W_100PPM: Resistor - 1%; Part Description: General Purpose Thick Film Chip Resistor; Manufacturer: GENERIC; Manufacturer1 Part Number: 232270674702; TC: ±100ppm/°C; Part Number: R0402_4K7_1%_0.0625W_100PPM; Component Kind: Standard; Component Type: Standard; Pin Count: 2; Value: 4k7; Status: Not recommended; Power: 0.0625W; Tolerance: ±1%; Manufacturer Part Number: R0402_4K7_1%_0.0625W_100PPM; Case: 0402; Mounted: Yes; Socket: No; SMD: Yes; Manufacturer1 Example: PHYCOMP; Manufacturer1 ComponentHeight: 0.4mm; HelpURL: \\cern.ch\dfs\Applications\Altium\Datasheets\R0402_Phycomp_RC0402.pdf; Author: CERN DEM JLC; CreateDate: 2007-12-03; LatestRevisionDate: 2008-03-13
SK1 = EEMB_BH500: Battery holder; Part Description: Battery holder for CR and LIR series1216 to 1220,1225; Manufacturer: EEMB; Part Number: EEMB_BH500; Component Kind: Standard; Component Type: Standard; Pin Count: 2; Mounted: Yes; Socket: No; SMD: Yes; Status: None; Device: BH500; Manufacturer Part Number: BH500; ComponentHeight: 4mm; Author: DEL; CreateDate: 22.10.2017; LatestRevisionDate: 22.10.2017
T1 = XFMR_LF-H84P-1: Signal Transformers 10/100 Base-T XFMR 1 Port LAN; Part Number: PE-68678; Part Description: 10/100BASE-Tx PC Card LAN Magnetics Module; Manufacturer: LANKom; Component Kind: Standard; Component Type: Standard; Pin Count: 16; Value: LF-H84P-1; Status: None; Manufacturer Part Number: LF-H84P-1; Mounted: Yes; Socket: No; SMD: No; ComponentHeight: 2mm; Author: DEL; CreateDate: 10.10.2017; LatestRevisionDate: 10.10.2017
TP1-TP9 = TP_SMD_0.8MM: Part Description: 0.8mm round SMD Pad; Mounted: No; Part Number: TP_SMD_0.8MM; Component Kind: Standard (No BOM); Component Type: Standard (No BOM); Pin Count: 1; Family: Test Point; Socket: No; SMD: No; Status: None; ComponentHeight: 0mm; Author: DEL; CreateDate: 14.11.2017; LatestRevisionDate: 14.11.2017; PackageDescription: 0.8mm round SMD Pad
U1 = TPS54260DGQ: Part Description: 3.5-V to 60-V Input, 2.5-A, Step-Down Converter; Manufacturer: TEXAS INSTRUMENTS; Part Number: TPS54260DGQ; Component Kind: Standard; Component Type: Standard; Device: TPS54260; PackageDescription: SOP, 0.50mm, pitch; 10 pin, 3.00mm W X 3.00mm L X 1.10mm H body (w/thermal tab  1.57 X 1.88 mm), IPC Medium Density; Manufacturer Part Number: TPS54260DGQ; Pin Count: 11; Case: DGQ 10; Mounted: Yes; Socket: No; SMD: Yes; ComponentHeight: 1.1mm; Author: DEL; CreateDate: 6/12/2025; LatestRevisionDate: 6/12/2025
U2 = RT9466: 5A Single Cell Li-Ion Switching Battery Charger with Power Path Management and USB-OTG Boost Mode; Part Description: Linear Li-Ion Charger with LDO; Manufacturer: Richtek; Part Number: RT9466; Component Kind: Standard; Component Type: Standard; Device: RT9466; PackageDescription: QFN,0.50mm pitch,square;6 pin X 6 pin,4.0mm X 4.0mm X 1.00mm H body (w/thermal tab 2.7 X 2.7mm),  IPC Medium Density; Manufacturer Part Number: RT9466; Pin Count: 25; Mounted: Yes; Socket: No; SMD: Yes; ComponentHeight: 1mm; Author: DEL; CreateDate: 6/3/2025; LatestRevisionDate: 6/3/2025
U3 = 24AA08T-I/OT: I2C™ Serial EEPROM SOT23-5 Package; Part Description: 8K Serial EEPROM; Manufacturer: MICROCHIP; Part Number: 24AA08T-I/OT; Component Kind: Standard; Component Type: Standard; Device: 24AA08; PackageDescription: SOT, 0.95mm pitch; 5 pin, 1.60mm W X 2.90mm L X 1.45mm H body, IPC Medium Density; Manufacturer Part Number: 24AA08T-I/OT; Pin Count: 5; Case: SOT23-5; Mounted: Yes; Socket: No; SMD: Yes; ComponentHeight: 1.45mm; Author: DEL; CreateDate: 09.11.2017; LatestRevisionDate: 09.11.2017
U4 = NUP4202W1: ESD Protection Diode, Low  Clamping Voltage; Manufacturer: ON SEMICONDUCTOR; Manufacturer Part Number: NUP4202W1T2G; Part Number: NUP4202W1; Component Kind: Standard; Component Type: Standard; Device: NUP4202; PackageDescription: SOT363, 0.65mm pitch; 6 pin, 1.25mm W X 2mm L, IPC Medium Density; Part Description: ESD Protection Diode, Low  Clamping Voltage; Pin Count: 6; Case: SOT363; Socket: No; SMD: Yes; ComponentHeight: 1.1mm; Author: DEL; CreateDate: 10.11.2017; LatestRevisionDate: 10.11.2017
U5 = TPS63001: Single Inductor Buck-Boost Converter With 1.8-A Switches; Manufacturer: TEXAS INSTRUMENTS; Manufacturer Part Number: TPS63001DRCT; Part Number: TPS63001; Component Kind: Standard; Component Type: Standard; Device: TPS63001; PackageDescription: VSON, 10 pin, 3.0mm X 3.0mm X 1mm; Part Description: Single Inductor Buck-Boost Converter With 1.8-A Switches; Pin Count: 10; Case: VSON10; Mounted: Yes; Socket: No; SMD: Yes; ComponentHeight: 1mm; Author: DEL; CreateDate: 8/23/2025; LatestRevisionDate: 8/23/2025
U6 = LAN8720A-CP-TR: Part Description: Small Footprint RMII 10/100 Ethernet Transceiver with HP Auto-MDIX Support; Manufacturer: Microchip; Part Number: LAN8720A-CP-TR; Component Kind: Standard; Component Type: Standard; Device: LAN8720; PackageDescription: QFN,0.50mm pitch,square;6 pin X 6 pin,4.0mm X 4.0mm X 1.00mm H body (w/thermal tab 2.65 X 2.65mm); Manufacturer Part Number: LAN8720A-CP-TR; Pin Count: 25; Case: QFN24; Mounted: Yes; Socket: No; SMD: Yes; ComponentHeight: 1mm; Author: DEL; CreateDate: 10.08.2017; LatestRevisionDate: 11.10.2017
U7 = STM32F407VGT6: ARM Cortex-M4 32b MCU+FPU, 210DMIPS, up to 1MB Flash/192+4KB RAM, USB OTG HS/FS, Ethernet, 17 TIMs, 3 ADCs, 15 comm. interfaces & camera; Manufacturer: ST Microelectronics; Part Number: STM32F407VGT6; Component Kind: Standard; Component Type: Standard; Device: STM32F407VGT6; PackageDescription: QFP, 0.50mm Pitch, Square; 100 Pin,14.00mm L X 14.00mm W X 1.60mm H Body; Part Description: ARM Cortex-M4 32b MCU+FPU, 210DMIPS, up to 1MB Flash/192+4KB RAM, USB OTG HS/FS, Ethernet, 17 TIMs, 3 ADCs, 15 comm. interfaces & camera; Manufacturer Part Number: STM32F407VGT6; Pin Count: 100; Case: LQFP100; Mounted: Yes; Socket: No; SMD: Yes; ComponentHeight: 1.6mm; Author: DEL; CreateDate: 6/3/2025; LatestRevisionDate: 6/3/2025
X1 = 32.768KHz_KX–327NHT: Quartz Crystal; Part Description: Quartz Crystal ±20ppm; Manufacturer: GEYER; Part Number: 32.768KHz_KX–327NHT; Component Kind: Standard; Component Type: Standard; PackageDescription: 2 pin, 3.20mm L X 1.50mm W X 0.80mm H; Value: 32.768KHZ; Manufacturer Part Number: KX–327NHT; Pin Count: 2; Mounted: Yes; Socket: No; SMD: Yes; ComponentHeight: 0.8mm; Author: D_EL; CreateDate: 15.06.2017; LatestRevisionDate: 15.06.2017
X2 = 24MHZ_XRCGB24M000F3M00R0: Crystal 4 pins 1=XTAL 2=GND3=XTAL 4=GND; Part Description: ± 30ppm at (25±3°C), -30°C to +85°C, 6pF, Ceramic SMD Crystal, Type HCR2016; Manufacturer: MURATA; Manufacturer Part Number: 7XRCGB24M000F3M00R0; Part Number: 24MHZ_XRCGB24M000F3M00R0; Component Kind: Standard; Component Type: Standard; PackageDescription: Oscillator, corner concave; 4 pin, 2.00mm L X 1.60mm W X 0.65mm H, IPC Medium Density; Value: 24MHZ; Pin Count: 4; Mounted: Yes; Socket: No; SMD: Yes; ComponentHeight: 0.7mm; Author: D_EL; CreateDate: 17.06.2017; LatestRevisionDate: 17.06.2017